# Altium schematic sheet Choin_zlacza.SchDoc
size A4; LotOfPieces: 1
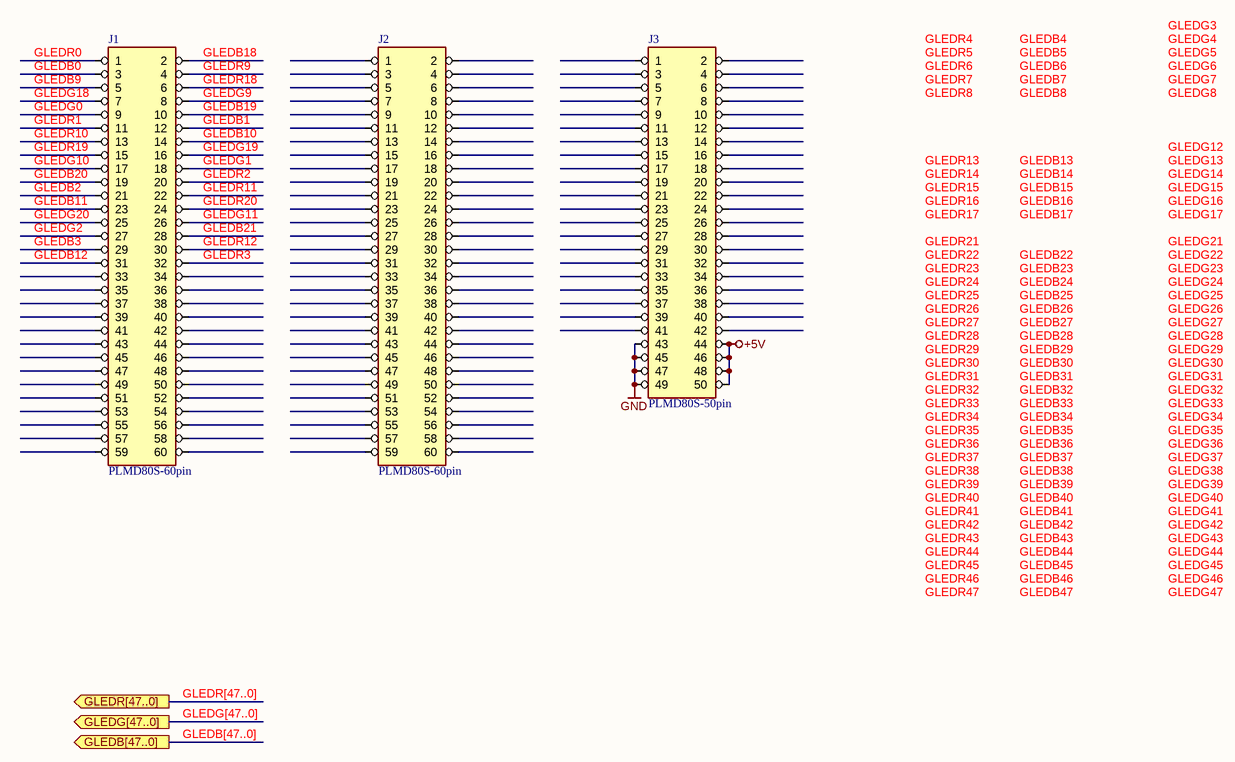
[diagram p0: Choin_zlacza.SchDoc]

## Parts
J1  PLMD80S-60pin  [PLMD60S]
J2  PLMD80S-60pin  [PLMD60S]
J3  PLMD80S-50pin  [PLMD50S]

## Ports
GLEDB[47..0], GLEDG[47..0], GLEDR[47..0]

## Nets
+5V: J3.44 J3.46 J3.48 J3.50
GND: J3.43 J3.45 J3.47 J3.49
GLEDB0: J1.3
GLEDB1: J1.12
GLEDB2: J1.21
GLEDB3: J1.29
GLEDB9: J1.5
GLEDB10: J1.14
GLEDB11: J1.23
GLEDB12: J1.31
GLEDB18: J1.2
GLEDB19: J1.10
GLEDB20: J1.19
GLEDB21: J1.28
GLEDG0: J1.9
GLEDG1: J1.18
GLEDG2: J1.27
GLEDG9: J1.8
GLEDG10: J1.17
GLEDG11: J1.26
GLEDG18: J1.7
GLEDG19: J1.16
GLEDG20: J1.25
GLEDR0: J1.1
GLEDR1: J1.11
GLEDR2: J1.20
GLEDR3: J1.32
GLEDR9: J1.4
GLEDR10: J1.13
GLEDR11: J1.22
GLEDR12: J1.30
GLEDR18: J1.6
GLEDR19: J1.15
GLEDR20: J1.24

Not connected (* = marked no-connect by the designer): J1 33 34 35 36 37 38 39 40 41 42 43 44 45 46 47 48 49 50 51 52 53 54 55 56 57 58 59 60; J2 1 2 3 4 5 6 7 8 9 10 11 12 13 14 15 16 17 18 19 20 21 22 23 24 25 26 27 28 29 30 31 32 33 34 35 36 37 38 39 40 41 42 43 44 45 46 47 48 49 50 51 52 53 54 55 56 57 58 59 60; J3 1 2 3 4 5 6 7 8 9 10 11 12 13 14 15 16 17 18 19 20 21 22 23 24 25 26 27 28 29 30 31 32 33 34 35 36 37 38 39 40 41 42

## Buses and harness runs
bus GLEDB[47..0] = port GLEDB[47..0]
bus GLEDG[47..0] = port GLEDG[47..0]
bus GLEDR[47..0] = port GLEDR[47..0]

## Notes on the sheet
- Labels drawn without touching a wire or pin: GLEDB4, GLEDB5, GLEDB6, GLEDB7, GLEDB8, GLEDB13, GLEDB14, GLEDB15, GLEDB16, GLEDB17, GLEDB22, GLEDB23, GLEDB24, GLEDB25, GLEDB26, GLEDB27, GLEDB28, GLEDB29, GLEDB30, GLEDB31, GLEDB32, GLEDB33, GLEDB34, GLEDB35, GLEDB36, GLEDB37, GLEDB38, GLEDB39, GLEDB40, GLEDB41, GLEDB42, GLEDB43, GLEDB44, GLEDB45, GLEDB46, GLEDB47, GLEDG3, GLEDG4, GLEDG5, GLEDG6, GLEDG7, GLEDG8, GLEDG12, GLEDG13, GLEDG14, GLEDG15, GLEDG16, GLEDG17, GLEDG21, GLEDG22, GLEDG23, GLEDG24, GLEDG25, GLEDG26, GLEDG27, GLEDG28, GLEDG29, GLEDG30, GLEDG31, GLEDG32, GLEDG33, GLEDG34, GLEDG35, GLEDG36, GLEDG37, GLEDG38, GLEDG39, GLEDG40, GLEDG41, GLEDG42, GLEDG43, GLEDG44, GLEDG45, GLEDG46, GLEDG47, GLEDR4, GLEDR5, GLEDR6, GLEDR7, GLEDR8, GLEDR13, GLEDR14, GLEDR15, GLEDR16, GLEDR17, GLEDR21, GLEDR22, GLEDR23, GLEDR24, GLEDR25, GLEDR26, GLEDR27, GLEDR28, GLEDR29, GLEDR30, GLEDR31, GLEDR32, GLEDR33, GLEDR34, GLEDR35, GLEDR36, GLEDR37, GLEDR38, GLEDR39, GLEDR40, GLEDR41, GLEDR42, GLEDR43, GLEDR44, GLEDR45, GLEDR46, GLEDR47
- Projekt i wykonanie: (C) Miroslaw Lach MRQ, www.mrq-ml.com
- SVNPath:
- Page:
- Rev.
- /
- Plik:

## Library data of the parts
J1 J2 = PLMD80S-60pin[[/\]]30x2x2mm: Descript: connector 2mm pitch, THT, 2x30pin, straight; Reference5: PLMD80S-LF; Currency5: PLN; Amount5: 1+; Value: PLMD80S-60pin; Dimensions: 30x2x2mm; ComponentLink1Description: Datasheet; ComponentLink1URL: http://www.mrq-ml.com/Parts/Connectors/plmd80s.pdf; Supplier5: maritex.com.pl; Price5: 1,39; DateOfPrice5: 2014-01-04
J3 = PLMD80S-50pin[[/\]]25x2x2mm: Descript: connector 2mm pitch, THT, 2x25pin, straight; Reference5: PLMD80S-LF; Currency5: PLN; Amount5: 1+; Value: PLMD80S-50pin; Dimensions: 25x2x2mm; ComponentLink1Description: Datasheet; ComponentLink1URL: http://www.mrq-ml.com/Parts/Connectors/plmd80s.pdf; Supplier5: maritex.com.pl; Price5: 1,39; DateOfPrice5: 2014-01-04